# Altium schematic sheet Sensors.SchDoc
size A
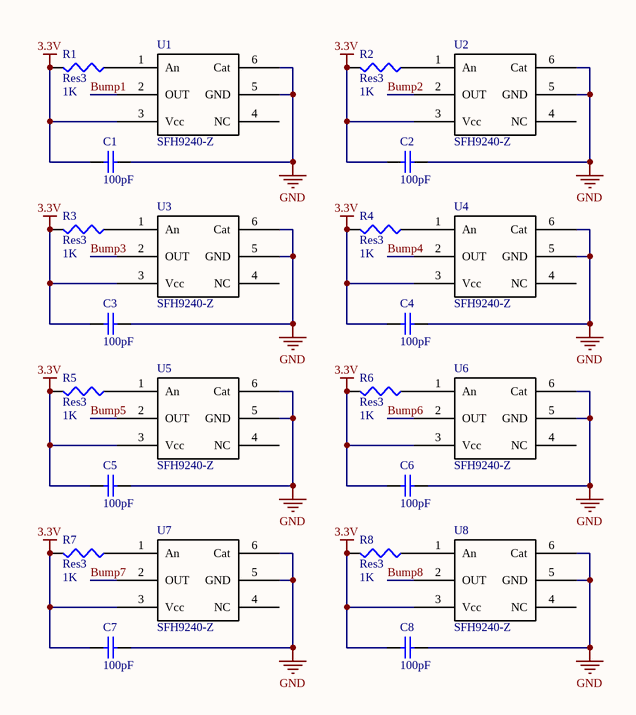
[diagram p0: Sensors.SchDoc]

## Parts
C1  value 100pF  [CAPC1005L]  (hidden comment: Cap Semi)
C2  value 100pF  [CAPC1005L]  (hidden comment: Cap Semi)
C3  value 100pF  [CAPC1005L]  (hidden comment: Cap Semi)
C4  value 100pF  [CAPC1005L]  (hidden comment: Cap Semi)
C5  value 100pF  [CAPC1005L]  (hidden comment: Cap Semi)
C6  value 100pF  [CAPC1005L]  (hidden comment: Cap Semi)
C7  value 100pF  [CAPC1005L]  (hidden comment: Cap Semi)
C8  value 100pF  [CAPC1005L]  (hidden comment: Cap Semi)
R1  Res3  value 1K  [RESC1608L]
R2  Res3  value 1K  [RESC1608L]
R3  Res3  value 1K  [RESC1608L]
R4  Res3  value 1K  [RESC1608L]
R5  Res3  value 1K  [RESC1608L]
R6  Res3  value 1K  [RESC1608L]
R7  Res3  value 1K  [RESC1608L]
R8  Res3  value 1K  [RESC1608L]
U1  SFH9240-Z  [SFH9240-Z]
U2  SFH9240-Z  [SFH9240-Z]
U3  SFH9240-Z  [SFH9240-Z]
U4  SFH9240-Z  [SFH9240-Z]
U5  SFH9240-Z  [SFH9240-Z]
U6  SFH9240-Z  [SFH9240-Z]
U7  SFH9240-Z  [SFH9240-Z]
U8  SFH9240-Z  [SFH9240-Z]

## Nets
3.3V: C1.2 C2.2 C3.2 C4.2 C5.2 C6.2 C7.2 C8.2 R1.2 R2.2 R3.2 R4.2 R5.2 R6.2 R7.2 R8.2 U1.3(Vcc) U2.3(Vcc) U3.3(Vcc) U4.3(Vcc) U5.3(Vcc) U6.3(Vcc) U7.3(Vcc) U8.3(Vcc)
GND: C1.1 C2.1 C3.1 C4.1 C5.1 C6.1 C7.1 C8.1 U1.5(GND) U1.6(Cat) U2.5(GND) U2.6(Cat) U3.5(GND) U3.6(Cat) U4.5(GND) U4.6(Cat) U5.5(GND) U5.6(Cat) U6.5(GND) U6.6(Cat) U7.5(GND) U7.6(Cat) U8.5(GND) U8.6(Cat)
Bump1: U1.2(OUT)
Bump2: U2.2(OUT)
Bump3: U3.2(OUT)
Bump4: U4.2(OUT)
Bump5: U5.2(OUT)
Bump6: U6.2(OUT)
Bump7: U7.2(OUT)
Bump8: U8.2(OUT)
NetR1_1: R1.1 U1.1(An)
NetR2_1: R2.1 U2.1(An)
NetR3_1: R3.1 U3.1(An)
NetR4_1: R4.1 U4.1(An)
NetR5_1: R5.1 U5.1(An)
NetR6_1: R6.1 U6.1(An)
NetR7_1: R7.1 U7.1(An)
NetR8_1: R8.1 U8.1(An)

Not connected (* = marked no-connect by the designer): U1 4(NC); U2 4(NC); U3 4(NC); U4 4(NC); U5 4(NC); U6 4(NC); U7 4(NC); U8 4(NC)

## Library data of the parts
C1-C8 = Cap Semi: Capacitor (Semiconductor SIM Model); Published: 8-Jun-2000; LatestRevisionDate: 29-May-2009; LatestRevisionNote: IPC-7351 Footprint Added.; PackageReference: C1206; Publisher: Altium Limited; PackageDescription: Chip Capacitor
R1-R8 = Res3: Resistor; Published: 8-Jun-2000; LatestRevisionDate: 29-May-2009; LatestRevisionNote: IPC-7351 Footprint Added.; PackageReference: J1-0603; Publisher: Altium Limited; PackageDescription: Chip Resistor